# Altium schematic sheet RS_232.SchDoc: LiveDesign Evaluation - EvalBoard Tester
size A4; Organization: Altium Limited; Address1: L3, 12a Rodborough Rd; Address2: Frenchs Forest; Address3: NSW; Address4: Australia 2086; DocumentNumber: 5; SheetNumber: 5; SheetTotal: 16
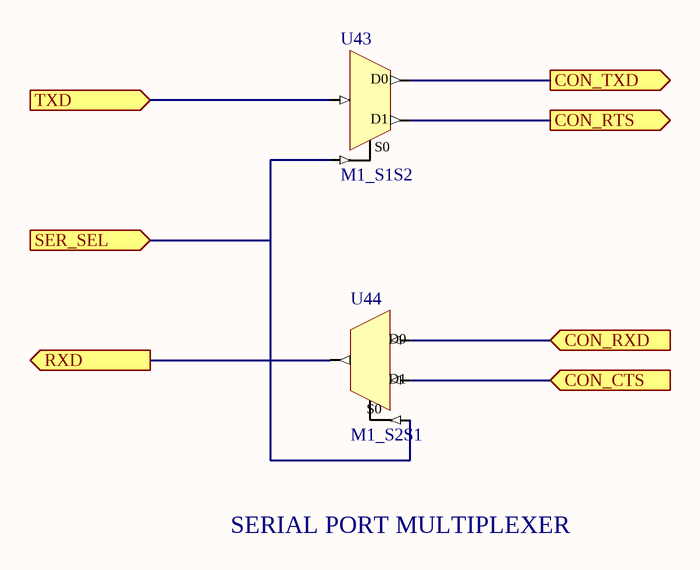
[diagram p0: RS_232.SchDoc]

## Parts
U43  M1_S1S2
U44  M1_S2S1

## Ports
CON_CTS (in), CON_RTS (out), CON_RXD (in), CON_TXD (out), RXD (out), SER_SEL (in), TXD (in)

## Nets
CON_CTS: U44.D1 ; port CON_CTS
CON_RTS: U43.D1 ; port CON_RTS
CON_RXD: U44.D0 ; port CON_RXD
CON_TXD: U43.D0 ; port CON_TXD
RXD: U44.O ; port RXD
SER_SEL: U43.S0 U44.S0 ; port SER_SEL
TXD: U43.O ; port TXD

## Notes on the sheet
- SERIAL PORT MULTIPLEXER
- Title
- Size:
- Date:
- A4
- Number:
- Time:
- Revision:
- Sheet
- of
- File:

## Library data of the parts
U43 = M1_S1S2: 1x1-Single Wire to 2x1-Single Wire Multiplexer (Demultiplex); Sub Class: S1Sn; Port Size: 1; Port Style: Single Pin Version; ArchiveName: GENERIC; VHDLIB_SIM: GENERIC_LIB; Published: 29-Jan-2004; Publisher: Altium Limited; Core Revision: 1.00.00; HelpURL: CR0118 FPGA Generic Library Guide.pdf#page=327; Functional Class: Multiplexer
U44 = M1_S2S1: 2x1-Single Wire to 1x1-Single Wire Multiplexer; Xilinx Equivalent: M2_1; Sub Class: SnS1; Port Size: 1; Port Style: Single Pin Version; ArchiveName: GENERIC; VHDLIB_SIM: GENERIC_LIB; Published: 29-Jan-2004; Publisher: Altium Limited; Core Revision: 1.00.00; HelpURL: CR0118 FPGA Generic Library Guide.pdf#page=358; Functional Class: Multiplexer